# Altium schematic sheet MB_mcu.SchDoc
size 594 x 420 mm; SheetNumber: 4; SheetTotal: 8
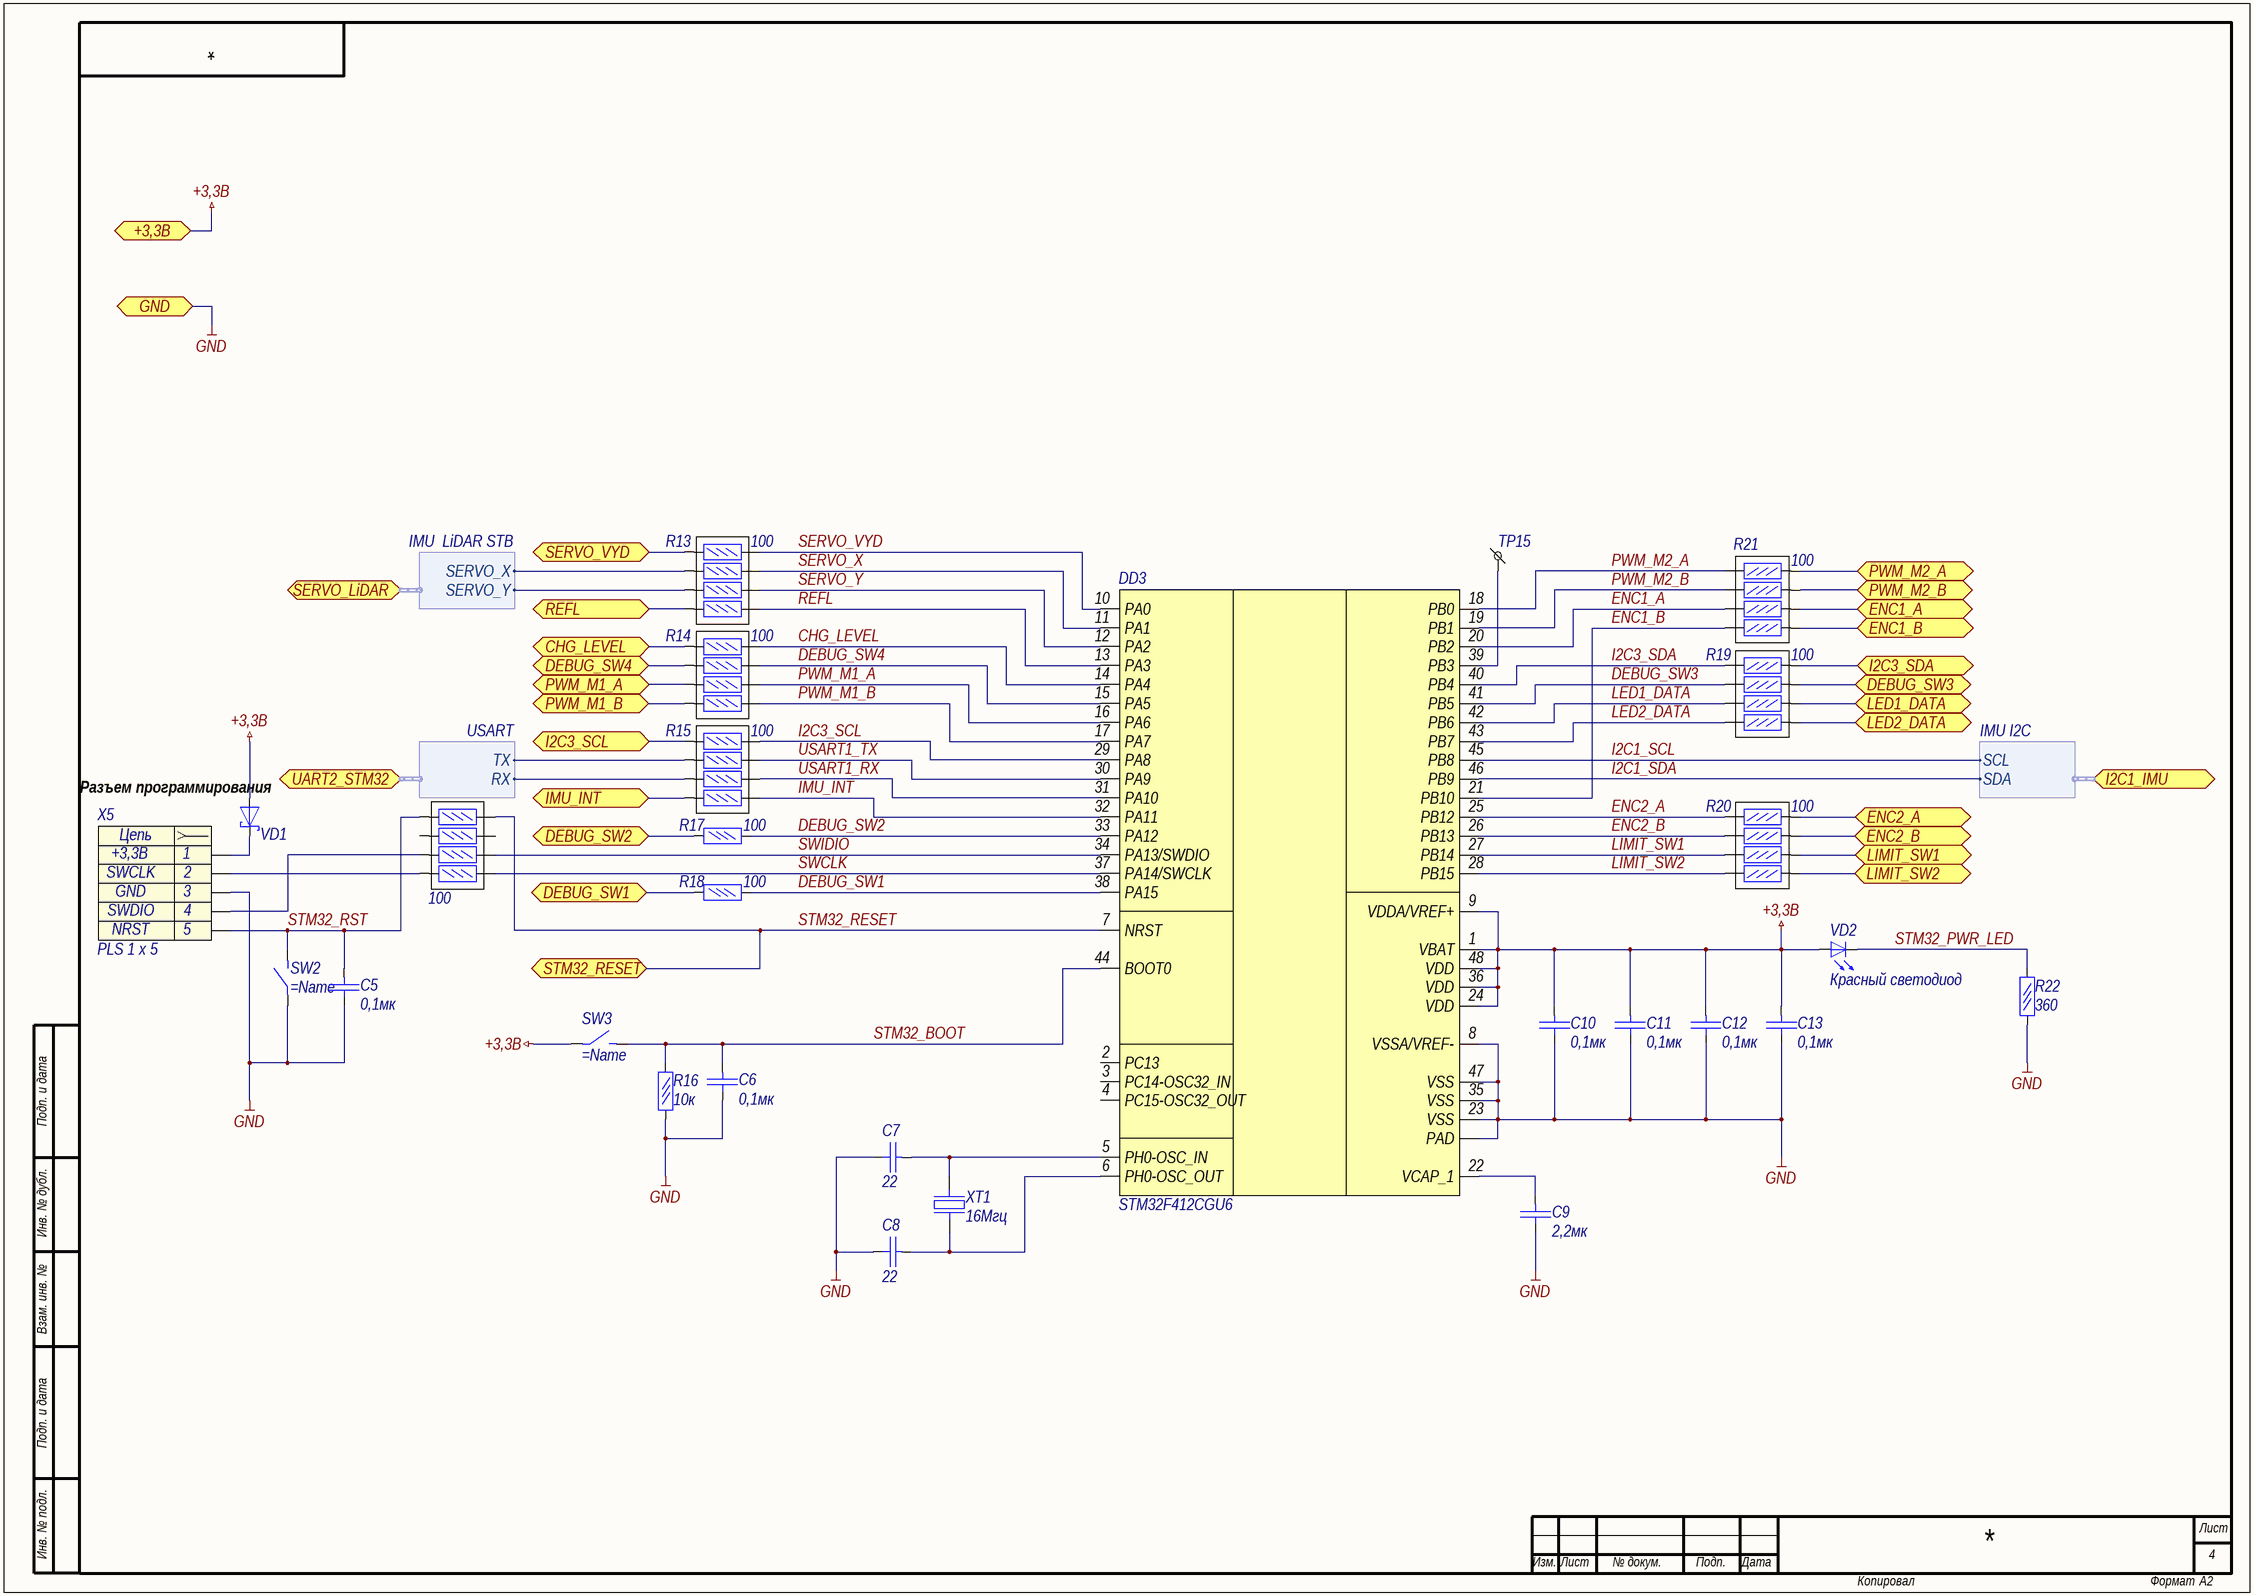
[diagram p0: MB_mcu.SchDoc]

## Parts
DD3  STM32F412CGU6  [UFQFPN48]
R12  100  [R0402x4]
R13  100  [R0402x4]
R14  100  [R0402x4]
R15  100  [R0402x4]
R16  10к  [R0402]
R17  100  [R0402]
R18  100  [R0402]
R19  100  [R0402x4]
R20  100  [R0402x4]
R21  100  [R0402x4]
R22  360  [R0402]
SW2  (no value)  [it-1187]
SW3  (no value)  [OMRON_B3U-1000P]
TP15  TestPoint  [0.5 x 0,9_round]  (value not drawn)
VD1  *  [SOD323]  (value not drawn)
VD2  Красный светодиод  [0603 - led - no point]
X5  PLS 1 x 5  [PLS_1x5 - emty]
XT1  16Мгц  [KX-7]
С5  0,1мк  [C0402]
С6  0,1мк  [C0402]
С7  22  [C0402]
С8  22  [C0402]
С9  2,2мк  [C0402]
С10  0,1мк  [C0402]
С11  0,1мк  [C0402]
С12  0,1мк  [C0402]
С13  0,1мк  [C0402]

## Ports
+3,3В (bidir), CHG_LEVEL (bidir), DEBUG_SW1 (bidir), DEBUG_SW2 (bidir), DEBUG_SW3 (bidir), DEBUG_SW4 (bidir), ENC1_A (bidir), ENC1_B (bidir), ENC2_A (bidir), ENC2_B (bidir), GND (bidir), I2C1_IMU (bidir, harness IMU I2C), I2C3_SCL (bidir), I2C3_SDA (bidir), IMU_INT (bidir), LED1_DATA (bidir), LED2_DATA (bidir), LIMIT_SW1 (bidir), LIMIT_SW2 (bidir), PWM_M1_A (bidir), PWM_M1_B (bidir), PWM_M2_A (bidir), PWM_M2_B (bidir), REFL (bidir), SERVO_LiDAR (bidir, harness IMU  LiDAR STB), SERVO_VYD (bidir), STM32_RESET (bidir), UART2_STM32 (bidir, harness USART)

## Harnesses
IMU I2C: SDA, SCL
USART: RX, TX
IMU  LiDAR STB: SERVO_Y, SERVO_X

## Nets
+3,3В: DD3.1(VBAT) DD3.9(VDDA/VREF+) DD3.24(VDD) DD3.36(VDD) DD3.48(VDD) SW3.1 VD1.2(A) VD2.1(A) С10.2 С11.2 С12.2 С13.2 ; port +3,3В
GND: DD3.8(VSSA/VREF-) DD3.23(VSS) DD3.35(VSS) DD3.47(VSS) DD3.49(PAD) R16.1 R22.2 SW2.1 X5.3 С5.1 С6.1 С7.1 С8.1 С9.1 С10.1 С11.1 С12.1 С13.1 ; port GND
CHG_LEVEL: DD3.14(PA4) R14.2
CHG_LEVEL: R14.1 ; port CHG_LEVEL  [a separate net that carries the same name]
DEBUG_SW1: R18.1 ; port DEBUG_SW1
DEBUG_SW1: DD3.38(PA15) R18.2  [a separate net that carries the same name]
DEBUG_SW2: R17.1 ; port DEBUG_SW2
DEBUG_SW2: DD3.33(PA12) R17.2  [a separate net that carries the same name]
DEBUG_SW3: DD3.41(PB5) R19.4
DEBUG_SW3: R19.3 ; port DEBUG_SW3  [a separate net that carries the same name]
DEBUG_SW4: DD3.15(PA5) R14.4
DEBUG_SW4: R14.3 ; port DEBUG_SW4  [a separate net that carries the same name]
ENC1_A: DD3.20(PB2) R21.6
ENC1_A: R21.5 ; port ENC1_A  [a separate net that carries the same name]
ENC1_B: DD3.21(PB10) R21.8
ENC1_B: R21.7 ; port ENC1_B  [a separate net that carries the same name]
ENC2_A: DD3.25(PB12) R20.2
ENC2_A: R20.1 ; port ENC2_A  [a separate net that carries the same name]
ENC2_B: DD3.26(PB13) R20.4
ENC2_B: R20.3 ; port ENC2_B  [a separate net that carries the same name]
I2C1_SCL: DD3.45(PB8) ; port I2C1_IMU.SCL
I2C1_SDA: DD3.46(PB9) ; port I2C1_IMU.SDA
I2C3_SCL: DD3.29(PA8) R15.2
I2C3_SCL: R15.1 ; port I2C3_SCL  [a separate net that carries the same name]
I2C3_SDA: DD3.40(PB4) R19.2
I2C3_SDA: R19.1 ; port I2C3_SDA  [a separate net that carries the same name]
IMU_INT: DD3.32(PA11) R15.8
IMU_INT: R15.7 ; port IMU_INT  [a separate net that carries the same name]
LED1_DATA: DD3.42(PB6) R19.6
LED1_DATA: R19.5 ; port LED1_DATA  [a separate net that carries the same name]
LED2_DATA: DD3.43(PB7) R19.8
LED2_DATA: R19.7 ; port LED2_DATA  [a separate net that carries the same name]
LIMIT_SW1: DD3.27(PB14) R20.6
LIMIT_SW1: R20.5 ; port LIMIT_SW1  [a separate net that carries the same name]
LIMIT_SW2: DD3.28(PB15) R20.8
LIMIT_SW2: R20.7 ; port LIMIT_SW2  [a separate net that carries the same name]
PWM_M1_A: DD3.16(PA6) R14.6
PWM_M1_A: R14.5 ; port PWM_M1_A  [a separate net that carries the same name]
PWM_M1_B: DD3.17(PA7) R14.8
PWM_M1_B: R14.7 ; port PWM_M1_B  [a separate net that carries the same name]
PWM_M2_A: DD3.18(PB0) R21.2
PWM_M2_A: R21.1 ; port PWM_M2_A  [a separate net that carries the same name]
PWM_M2_B: DD3.19(PB1) R21.4
PWM_M2_B: R21.3 ; port PWM_M2_B  [a separate net that carries the same name]
REFL: DD3.13(PA3) R13.8
REFL: R13.7 ; port REFL  [a separate net that carries the same name]
SERVO_VYD: DD3.10(PA0) R13.2
SERVO_VYD: R13.1 ; port SERVO_VYD  [a separate net that carries the same name]
SERVO_X: DD3.11(PA1) R13.4
SERVO_Y: DD3.12(PA2) R13.6
STM32_BOOT: DD3.44(BOOT0) R16.2 SW3.2 С6.2
STM32_PWR_LED: R22.1 VD2.2(K)
STM32_RESET: DD3.7(NRST) R12.2 ; port STM32_RESET
STM32_RST: R12.1 SW2.2 X5.5 С5.2
SWCLK: DD3.37(PA14/SWCLK) R12.8
SWIDIO: DD3.34(PA13/SWDIO) R12.6
USART1_RX: DD3.31(PA10) R15.6
USART1_TX: DD3.30(PA9) R15.4
NetDD3_5: DD3.5(PH0-OSC_IN) XT1.3 С7.2
NetDD3_6: DD3.6(PH0-OSC_OUT) XT1.1 С8.2
NetDD3_22: DD3.22(VCAP_1) С9.2
NetDD3_39: DD3.39(PB3) TP15.1
NetR12_5: R12.5 X5.4
NetR12_7: R12.7 X5.2
NetR13_3: R13.3 ; port SERVO_LiDAR.SERVO_X
NetR13_5: R13.5 ; port SERVO_LiDAR.SERVO_Y
NetR15_3: R15.3 ; port UART2_STM32.TX
NetR15_5: R15.5 ; port UART2_STM32.RX
NetVD1_1: VD1.1(K) X5.1

Not connected (* = marked no-connect by the designer): DD3 2(PC13) 3(PC14-OSC32_IN) 4(PC15-OSC32_OUT); R12 3 4

## Notes on the sheet
- (near VD1) Разъем программирования
- Подп. и дата
- Инв. № дубл.
- Взам. инв. №
- Инв. № подл.
- Лист
- Изм.
- № докум.
- Подп.
- Дата
- Копировал
- Формат
- А2
- (in symbol PLS 1 x 5) Цепь

## Library data of the parts
DD3 = STM32F412CGU6: микроконтроллер STM32F412, 48-UFQFPN, 100 MHz, 1024kB FLASH, 320kB RAM; Name: STM32F412CGU6
R12-R15 R19-R21 = Резисторная сборка 0.05 x 4: Value: 100
R16-R18 R22 = Резистор 0.05Вт: Резистор 0,05Вт
  R16: Value: 10к
  R17 R18: Value: 100
  R22: Value: 360
SW2 SW3 = button
VD1 = Diode Shottky: Диод Шоттки; Name: *
VD2 = SMD светодиод: Светодтод SMD; Name: Красный светодиод
X5 = PLS 1 x 5: Contact_1: +3,3В; Contact_2: SWCLK; Contact_3: GND; Contact_4: SWDIO; Contact_5: NRST; Name: PLS 1 x 5
XT1 = 12.88605: Резонатор / Geyer; Name: 12.88605; Value: 16Мгц
С5-С13 = Кер. конденсатор
  С5 С6 С10-С13: Value: 0,1мк
  С7 С8: Value: 22
  С9: Value: 2,2мк